# EAGLE schematic brainslug_34drc (EAGLE 6.5.0)
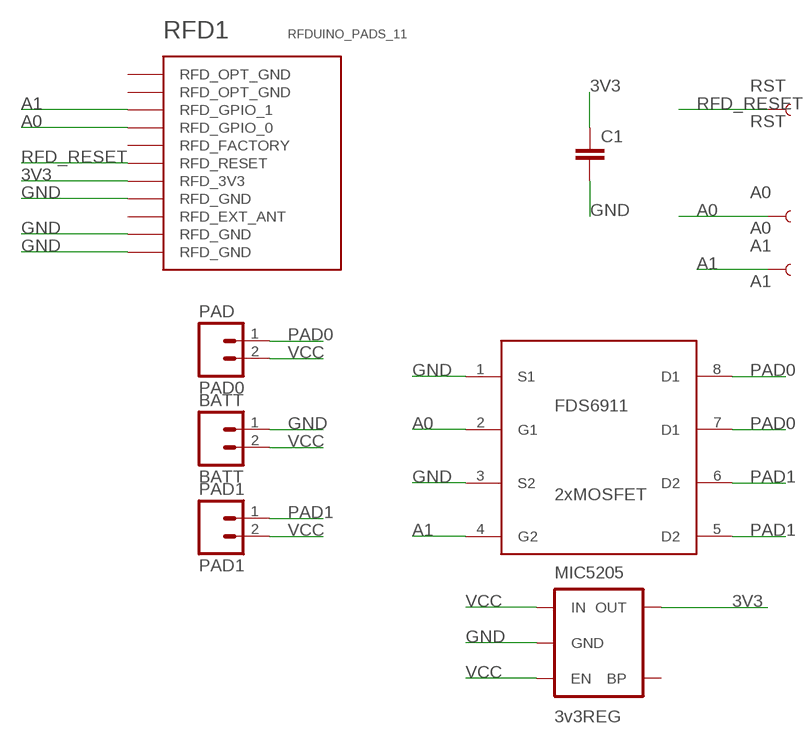
[diagram p0: schematic, sheet 1]

## Parts
A0  A0  TEST-POINT3  [PAD.03X.03]
A1  A1  TEST-POINT3  [PAD.03X.03]
BATT  BATT  M02-JST-2MM-SMT  [JST-2-SMD]
C1  CAP  [C3216]
FDS6911  2xMOSFET  FDS6911  [SO8]
MIC5205  3v3REG  MIC52053.3V  [SOT23-5]
PAD  PAD0  M02-JST-2MM-SMT  [JST-2-SMD]
PAD1  PAD1  M02-JST-2MM-SMT  [JST-2-SMD]
RFD1  RFDUINO_PADS_11  [RFDUINO_PADS]
RST  RST  TEST-POINT3  [PAD.03X.03]

## Nets
3V3: C1.1 MIC5205.5(OUT) RFD1.RFD_3V3
A0: A0.P$1 FDS6911.2(G1) RFD1.RFD_GPIO_0
A1: A1.P$1 FDS6911.4(G2) RFD1.RFD_GPIO_1
GND: BATT.1 C1.2 FDS6911.1(S1) FDS6911.3(S2) MIC5205.2(GND) RFD1.RFD_GND@0(RFD_GND) RFD1.RFD_GND@1(RFD_GND) RFD1.RFD_GND@2(RFD_GND)
PAD0: FDS6911.7(D1) FDS6911.8(D1) PAD.1
PAD1: FDS6911.5(D2) FDS6911.6(D2) PAD1.1
RFD_RESET: RFD1.RFD_RESET RST.P$1
VCC: BATT.2 MIC5205.1(IN) MIC5205.3(EN) PAD1.2 PAD.2
Unconnected: MIC5205.4(BP) RFD1.RFD_EXT_ANT RFD1.RFD_FACTORY RFD1.RFD_OPT_GND@0(RFD_OPT_GND) RFD1.RFD_OPT_GND@1(RFD_OPT_GND)

## Library data of the parts
A0 A1 RST = SparkFun-Passives:TEST-POINT: Bare copper test points for troubleshooting or ICT
BATT PAD PAD1 = SparkFun-Connectors:M02: Header 2 Standard 2-pin 0.1" header. Use with straight break away headers (SKU : PRT-00116), right angle break away headers (PRT-00553), swiss pins (PRT-00743), machine pins (PRT-00117), and female headers (PRT-00115). Molex polarized connector foot print use with SKU : PRT-08233 with associated crimp pins and housings.
C1 = AKA_test:CAP: Capacitor Standard 0603 ceramic capacitor, and 0.1" leaded capacitor.
FDS6911 = AKA_test:FDS6911: FDS6911 Dual N-Channel Logic Level PowerTrench® MOSFET 20V, 7.5A, 13mΩ
MIC5205 = SparkFun-PowerIC:MIC5205: MIC5205 150mA vreg 3.3V - VREG-00822 5V - VREG-00823; PROD_ID: VREG-00822
RFD1 = AKA_test:RFDUINO_PADS_11: RFDuino solder pads for custom breakout boards. This is the power and programming side of the board, not the side with general GPIOs